# Altium schematic sheet EV75E52A_R3_1-Title.SchDoc
size Tabloid; DocumentNumber: 1; SheetNumber: 1; PageSetup: Record=PageOptions|CenterHorizontal=True|CenterVertical=True|PrintScale=1.02|XCorrection=1.00|YCorrection=1.00|PrintKind=0|BorderSize=5000000|LeftOffset=0|BottomOffset=0|Orientation=2|PaperLength=1000|PaperWidth=1000|Scale=100|PaperSource=15|PrintQuality=600|MediaType=1|DitherType=10|PrintScaleMode=1|PaperKind=11x17|PaperIndex=17; PageTitle: Title Page; SheetTitle: Title Page; DocumentFullPathAndName: //depot_np_hweng_boards/ung_hweng/UNG_8017_EVB-USB5926/
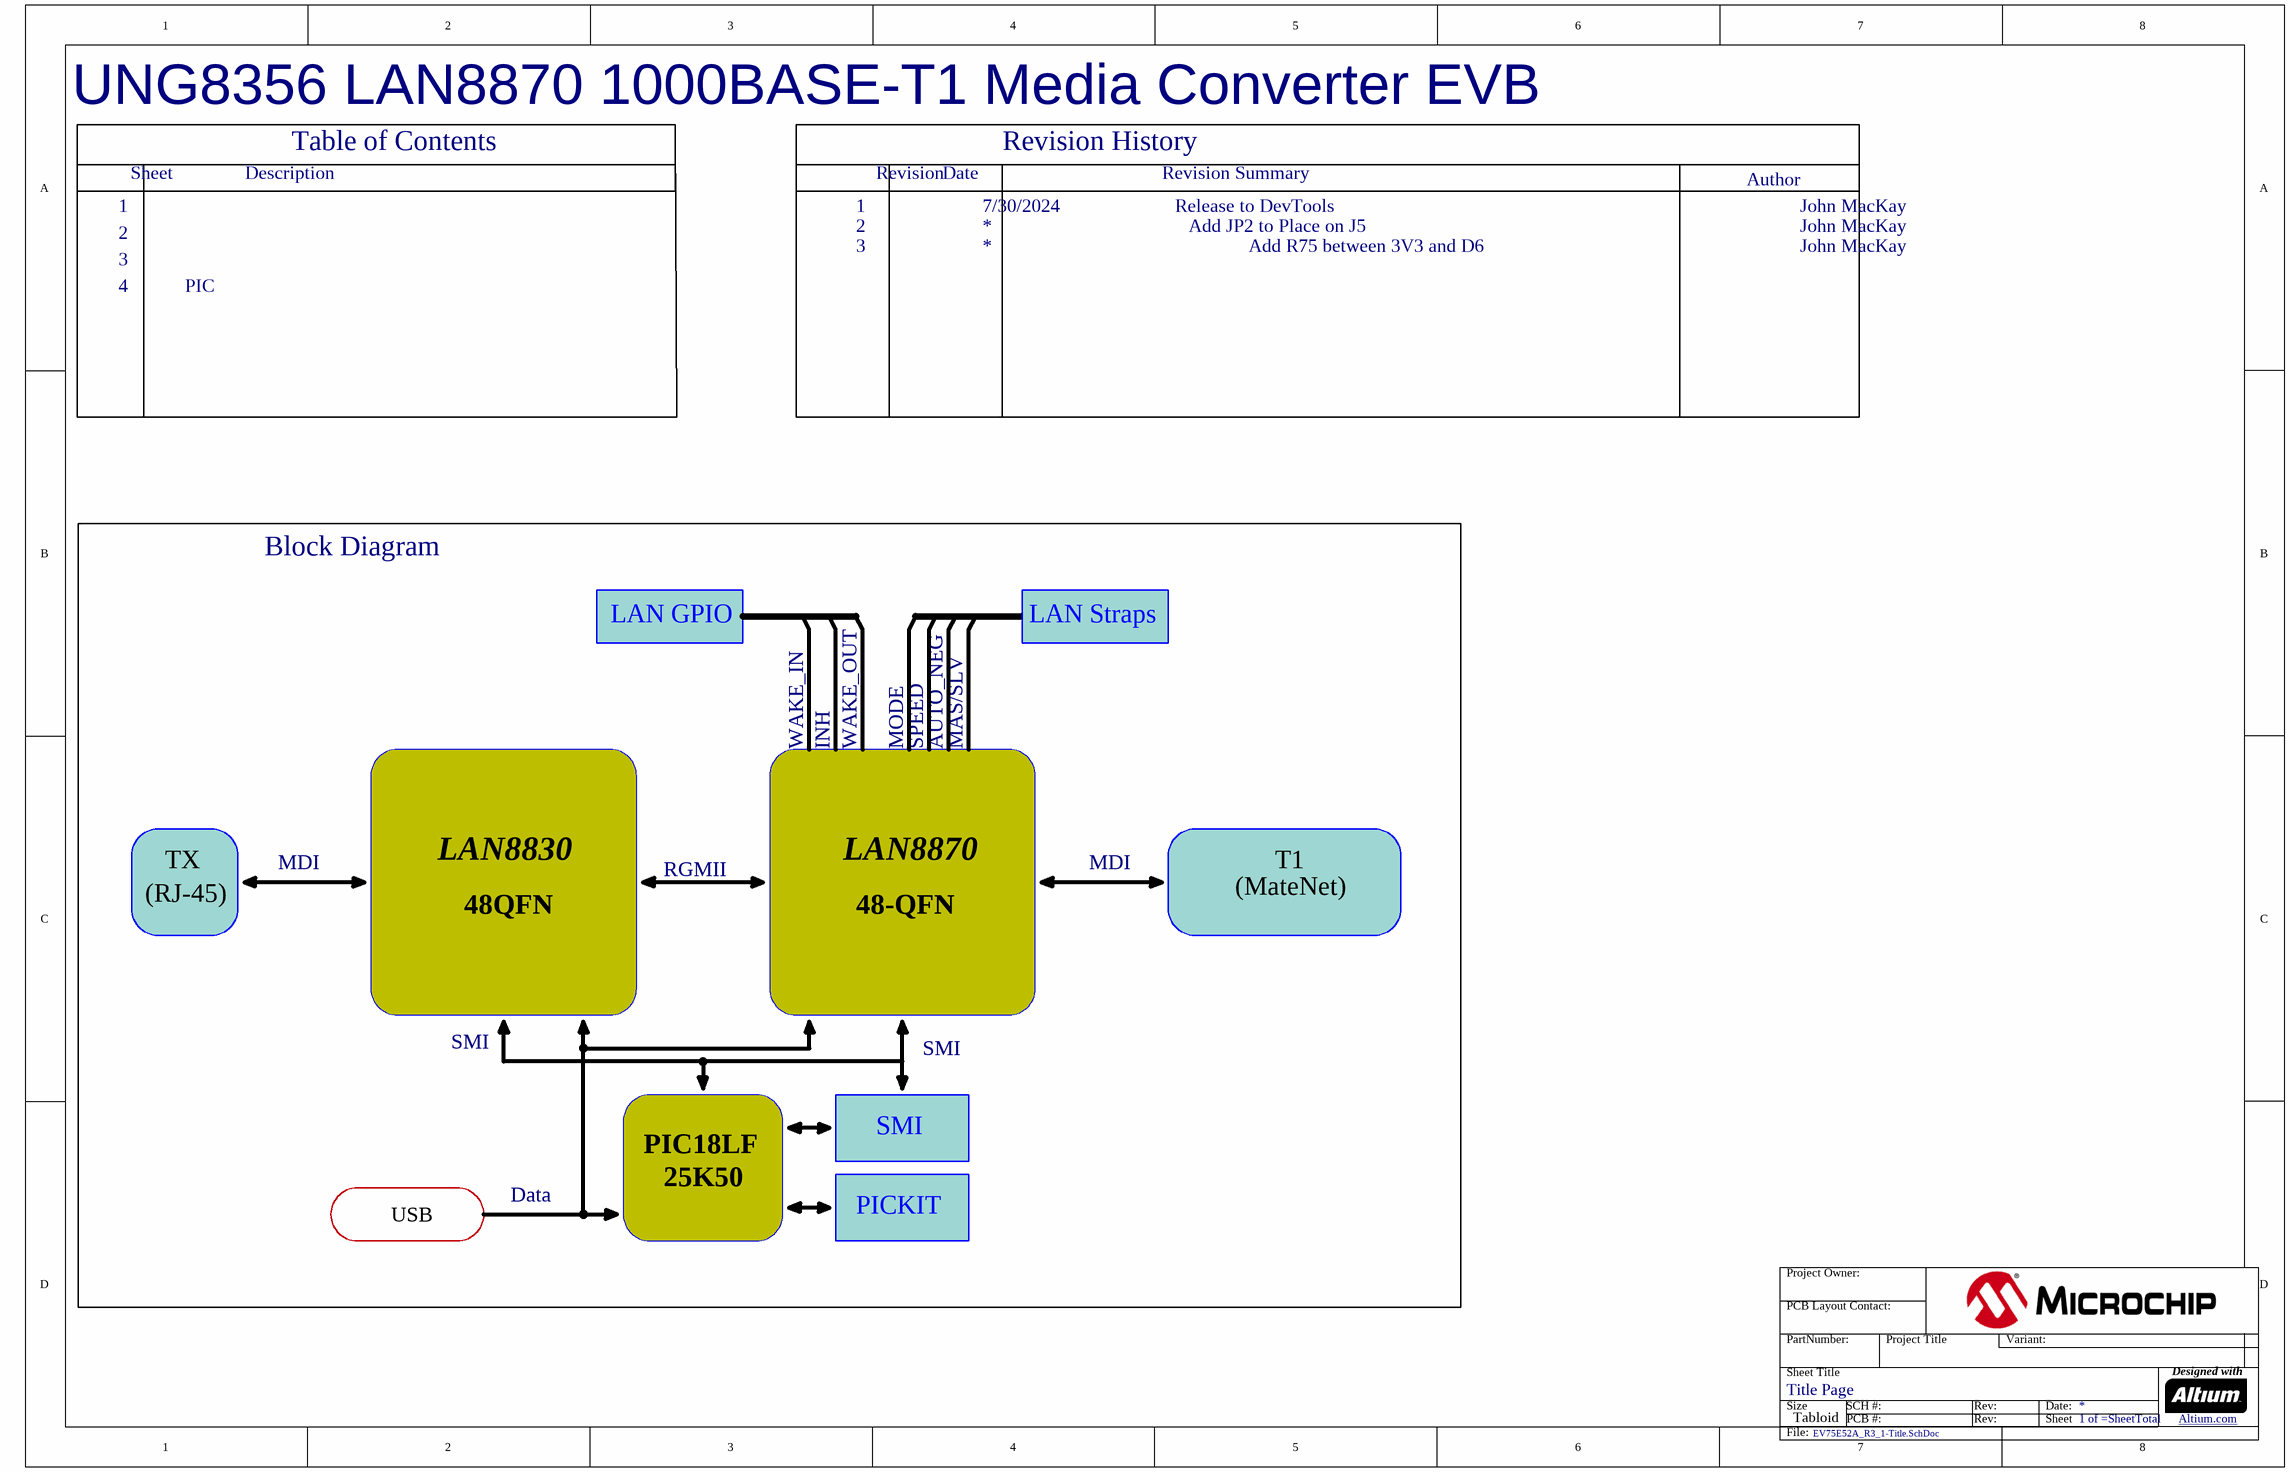
[diagram p0: EV75E52A_R3_1-Title.SchDoc]

## Notes on the sheet
- UNG8356 LAN8870 1000BASE-T1 Media Converter EVB
- Table of Contents
- Revision History
- 1
- Sheet
- Description
- Revision
- Date
- 7/30/2024
- Revision Summary
- Release to DevTools
- Author
- John MacKay
- 2
- 3
- 4
- PIC
- Add JP2 to Place on J5
- Add R75 between 3V3 and D6
- Block Diagram
- LAN GPIO
- LAN Straps
- WAKE_IN
- INH
- WAKE_OUT
- MODE
- SPEED
- AUTO_NEG
- MAS/SLV
- TX
- MDI
- LAN8830
- RGMII
- LAN8870
- T1
- (RJ-45)
- 48QFN
- 48-QFN
- (MateNet)
- SMI
- PIC18LF
- USB
- Data
- 25K50
- PICKIT
- Project Owner:
- PCB Layout Contact:
- PartNumber:
- Project Title
- Variant:
- Sheet Title
- Size
- Tabloid
- SCH #:
- PCB #:
- Rev:
- Date:
- Designed with
- Altium.com <http://go.altium.com/MicrochipLandingPage_Evaluation.html>
- File: